# Altium schematic sheet ESP32C6.SchDoc
size A4; SheetNumber: 3; SheetTotal: 5
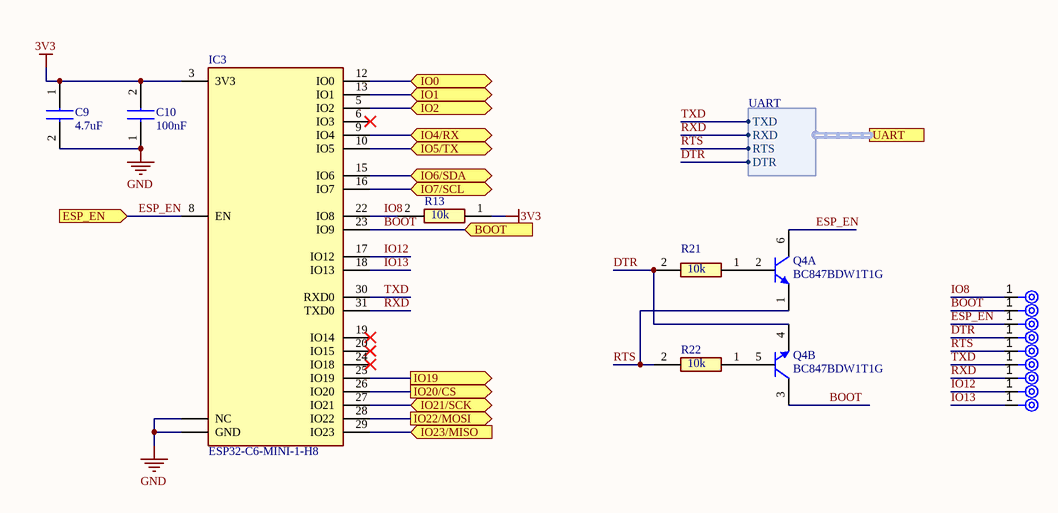
[diagram p0: ESP32C6.SchDoc]

## Parts
C9  4.7uF  [CAPC1608X90N]
C10  100nF  [CAPC1005X70N]
IC3  ESP32-C6-MINI-1-H8  [ESP32C6MINI1H8]
Q4  BC847BDW1T1G  [ONSC-SOT-363-6-419B-02_W_V]  (parts A,B of 2)
R13  10k  [RESC1005X35N]
R21  10k  [RESC1005X35N]
R22  10k  [RESC1005X35N]
TP4  TPAD6R  [TP06R]  (value not drawn)  (no BOM)
TP5  TPAD6R  [TP06R]  (value not drawn)  (no BOM)
TP6  TPAD6R  [TP06R]  (value not drawn)  (no BOM)
TP7  TPAD6R  [TP06R]  (value not drawn)  (no BOM)
TP8  TPAD6R  [TP06R]  (value not drawn)  (no BOM)
TP9  TPAD6R  [TP06R]  (value not drawn)  (no BOM)
TP10  TPAD6R  [TP06R]  (value not drawn)  (no BOM)
TP11  TPAD6R  [TP06R]  (value not drawn)  (no BOM)
TP12  TPAD6R  [TP06R]  (value not drawn)  (no BOM)

## Ports
BOOT (in, see main[3B]), ESP_EN (in, see main[3B]), IO0 (bidir, see main[4B]), IO1 (bidir, see main[4B]), IO2 (bidir, see main[4B]), IO4/RX (bidir, see main[4B]), IO5/TX (bidir, see main[4B]), IO6/SDA (bidir, see main[4B]), IO7/SCL (bidir, see main[4B]), IO19 (out, see main[3C]), IO20/CS (out, see main[4B]), IO21/SCK (bidir, see main[4B]), IO22/MOSI (out, see main[4B]), IO23/MISO (in, see main[4B]), UART (harness UART, see main[3B], USB-C[8B])

## Harnesses
UART: TXD, RXD, RTS, DTR

## Nets
3V3: C9.1 C10.2 IC3.3(3V3) R13.1
GND: C9.2 C10.1 IC3.1(GND) IC3.21(NC)
BOOT: IC3.23(IO9) Q4.3(C) TP5.1(TP) ; port BOOT
DTR: Q4.4(E) R21.2 TP7.1(TP) ; port UART.DTR
ESP_EN: IC3.8(EN) Q4.6(C) TP6.1(TP) ; port ESP_EN
IO0: IC3.12(IO0) ; port IO0
IO1: IC3.13(IO1) ; port IO1
IO2: IC3.5(IO2) ; port IO2
IO4/RX: IC3.9(IO4) ; port IO4/RX
IO5/TX: IC3.10(IO5) ; port IO5/TX
IO6/SDA: IC3.15(IO6) ; port IO6/SDA
IO7/SCL: IC3.16(IO7) ; port IO7/SCL
IO8: IC3.22(IO8) R13.2 TP4.1(TP)
IO12: IC3.17(IO12) TP11.1(TP)
IO13: IC3.18(IO13) TP12.1(TP)
IO19: IC3.25(IO19) ; port IO19
IO20/CS: IC3.26(IO20) ; port IO20/CS
IO21/SCK: IC3.27(IO21) ; port IO21/SCK
IO22/MOSI: IC3.28(IO22) ; port IO22/MOSI
IO23/MISO: IC3.29(IO23) ; port IO23/MISO
RTS: Q4.1(E) R22.2 TP8.1(TP) ; port UART.RTS
RXD: IC3.31(TXD0) TP10.1(TP) ; port UART.RXD
TXD: IC3.30(RXD0) TP9.1(TP) ; port UART.TXD
NetQ4_2: Q4.2(B) R21.1
NetQ4_5: Q4.5(B) R22.1

Not connected (* = marked no-connect by the designer): IC3 6(IO3)* 19(IO14)* 20(IO15)* 24(IO18)*

## Notes on the sheet
- Title:
- Date:
- Project:
- Type:
- Schematic
- Variant:
- Revision:
- Sheet
- of
- Author:
- Evžen Šteif
- Size:
- A4

## Library data of the parts
C9 = GRM188R61E475KE11J: Capacitor; Manufacturer_Name: Murata Electronics; Datasheet Link: https://search.murata.co.jp/Ceramy/image/img/A01X/G101/ENG/GRM188R61E475KE11-01A.pdf; Height: 0.9mm; Manufacturer_Part_Number: GRM188R61E475KE11J; Mouser Part Number: 81-GRM188R61E475KE1J; Mouser Price/Stock: https://www.mouser.co.uk/ProductDetail/Murata-Electronics/GRM188R61E475KE11J?qs=hNud%2FORuBR3%2Fa9GLJFT8KA%3D%3D; Arrow Part Number: GRM188R61E475KE11J; Arrow Price/Stock: https://www.arrow.com/en/products/grm188r61e475ke11j/murata-manufacturing
C10 = GRM155R61A104KA01D: Capacitor; Manufacturer_Name: Murata Electronics; Datasheet Link: https://search.murata.co.jp/Ceramy/image/img/A01X/G101/ENG/GRM155R61A104KA01-02A.pdf; Height: 0.7mm; Manufacturer_Part_Number: GRM155R61A104KA01D; Mouser Part Number: 81-GRM155R61A104KA01; Mouser Price/Stock: https://www.mouser.co.uk/ProductDetail/Murata-Electronics/GRM155R61A104KA01D?qs=5bAuhL3RhmNZw0v59AqOJA%3D%3D; Arrow Part Number: GRM155R61A104KA01D; Arrow Price/Stock: https://www.arrow.com/en/products/grm155r61a104ka01d/murata-manufacturing?utm_currency=USD&region=europe
IC3 = ESP32-C6-MINI-1-H8: Integrated Circuit; pin to pad: 1>PGND 21>NC; Manufacturer_Name: Espressif Systems; Datasheet Link: https://www.mouser.ph/ProductDetail/Espressif-Systems/ESP32-C6-MINI-1-H8?qs=olJun0bQHM8q1UR%2FHSWi2A%3D%3D; Height: 2.55mm; Manufacturer_Part_Number: ESP32-C6-MINI-1-H8; Mouser Part Number: 356-ESP32C6MINI1H8; Mouser Price/Stock: https://www.mouser.co.uk/ProductDetail/Espressif-Systems/ESP32-C6-MINI-1-H8?qs=olJun0bQHM8q1UR%2FHSWi2A%3D%3D
Q4 = CMP-1048-00875-1: Dual General Purpose Transistors, NPN, 6-Pin SOT-363, Pb-Free, Tape and Reel; Manufacturer: On Semiconductor; fT Min (MHz): 100; IC Continuous (A): 0.1; Polarity: Dual NPN; ComponentLink3Description: Package Specification; PackageReference: SOT-363-6-419B-02_W; RoHS: TRUE; PackageVersion: Rev. W, 01/2006; Packing: Tape and Reel; Mounting Technology: Surface Mount; ComponentLink3URL: http://www.onsemi.com/pub_link/Collateral/NTJD4001N-D.PDF; ComponentLink2URL: http://www.onsemi.cn/pub_link/Collateral/BC846BDW1T1-D.PDF; ComponentLink2Description: Datasheet; ComponentLink1Description: Manufacturer URL; PartNumber: BC847BDW1T1G; DatasheetVersion: Rev. 9; PackageDescription: 6-Pin Small Outline Transistor, Body 2 x 1.25 mm, Pitch 0.65 mm; ComponentLink1URL: http://www.onsemi.com/
R13 R21 R22 = RT0402FRE0710KL: Resistor; Manufacturer_Name: KEMET; Datasheet Link: https://cz.mouser.com/datasheet/2/447/PYu_RT_1_to_0_01_RoHS_L_15-3461507.pdf; Height: 0.35mm; Manufacturer_Part_Number: RT0402FRE0710KL; Mouser Part Number: 603-RT0402FRE0710KL; Mouser Price/Stock: https://www.mouser.co.uk/ProductDetail/YAGEO/RT0402FRE07100KL?qs=BXCcY9r%252B08CxTvf5JB1kiw%3D%3D; Arrow Part Number: RT0402FRE07100KL; Arrow Price/Stock: https://www.arrow.com/en/products/rt0402fre07100kl/yageo
TP4-TP12 = CMP-00028-00002-2: 0.6mm round; Pins: 1